# Altium schematic sheet SCH-HC15C_REV1_PG3.SchDoc: MODEL: HC 15C
size 863 x 558 mm; DocumentNumber: SCH-HC15C; SheetNumber: 3; SheetTotal: 3; Title2: HAB'S 1ST GEN CALCULATOR
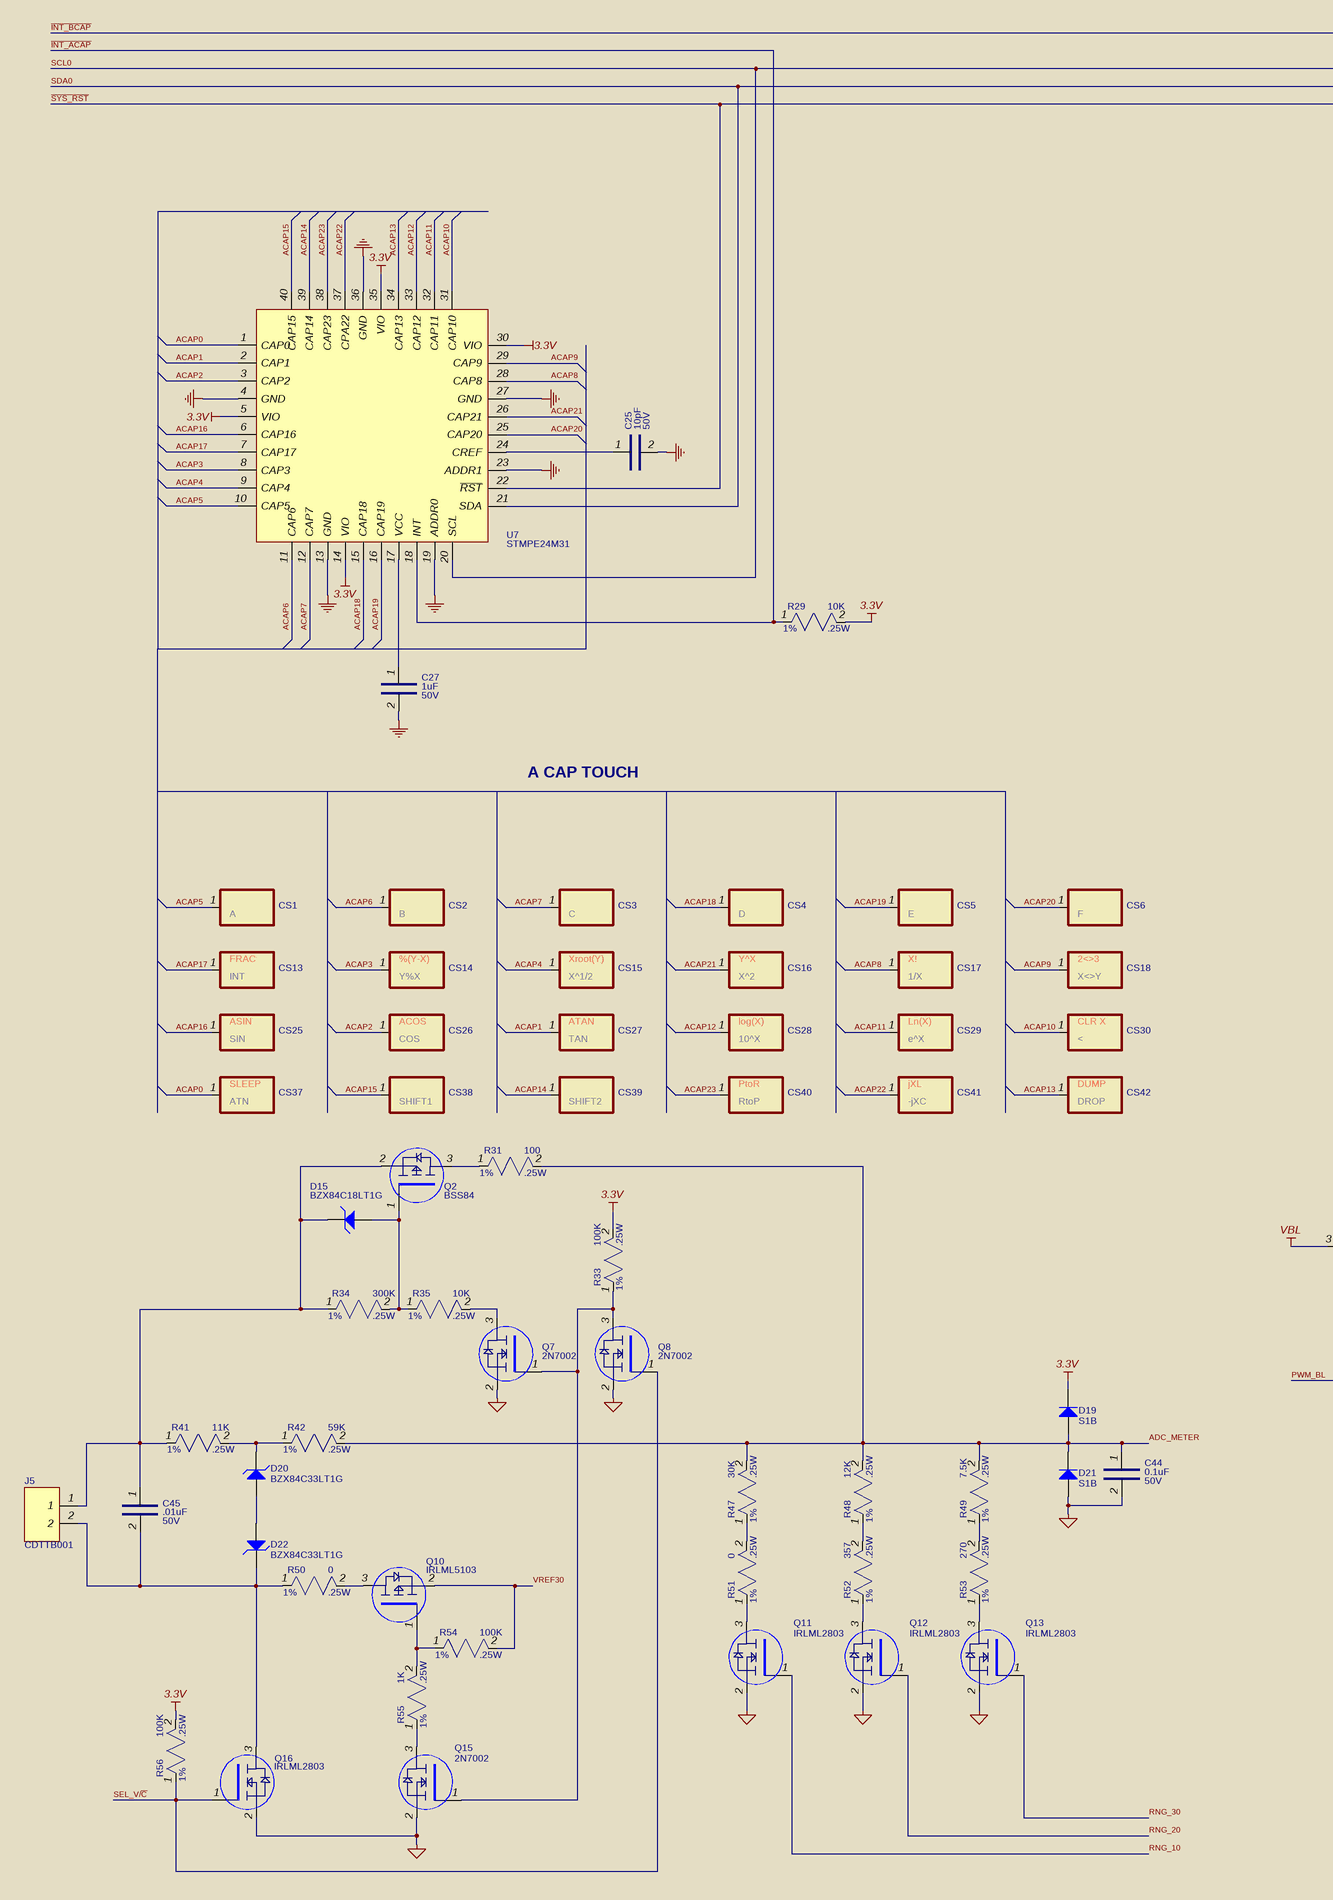
[diagram p0: SCH-HC15C_REV1_PG3.SchDoc, left]
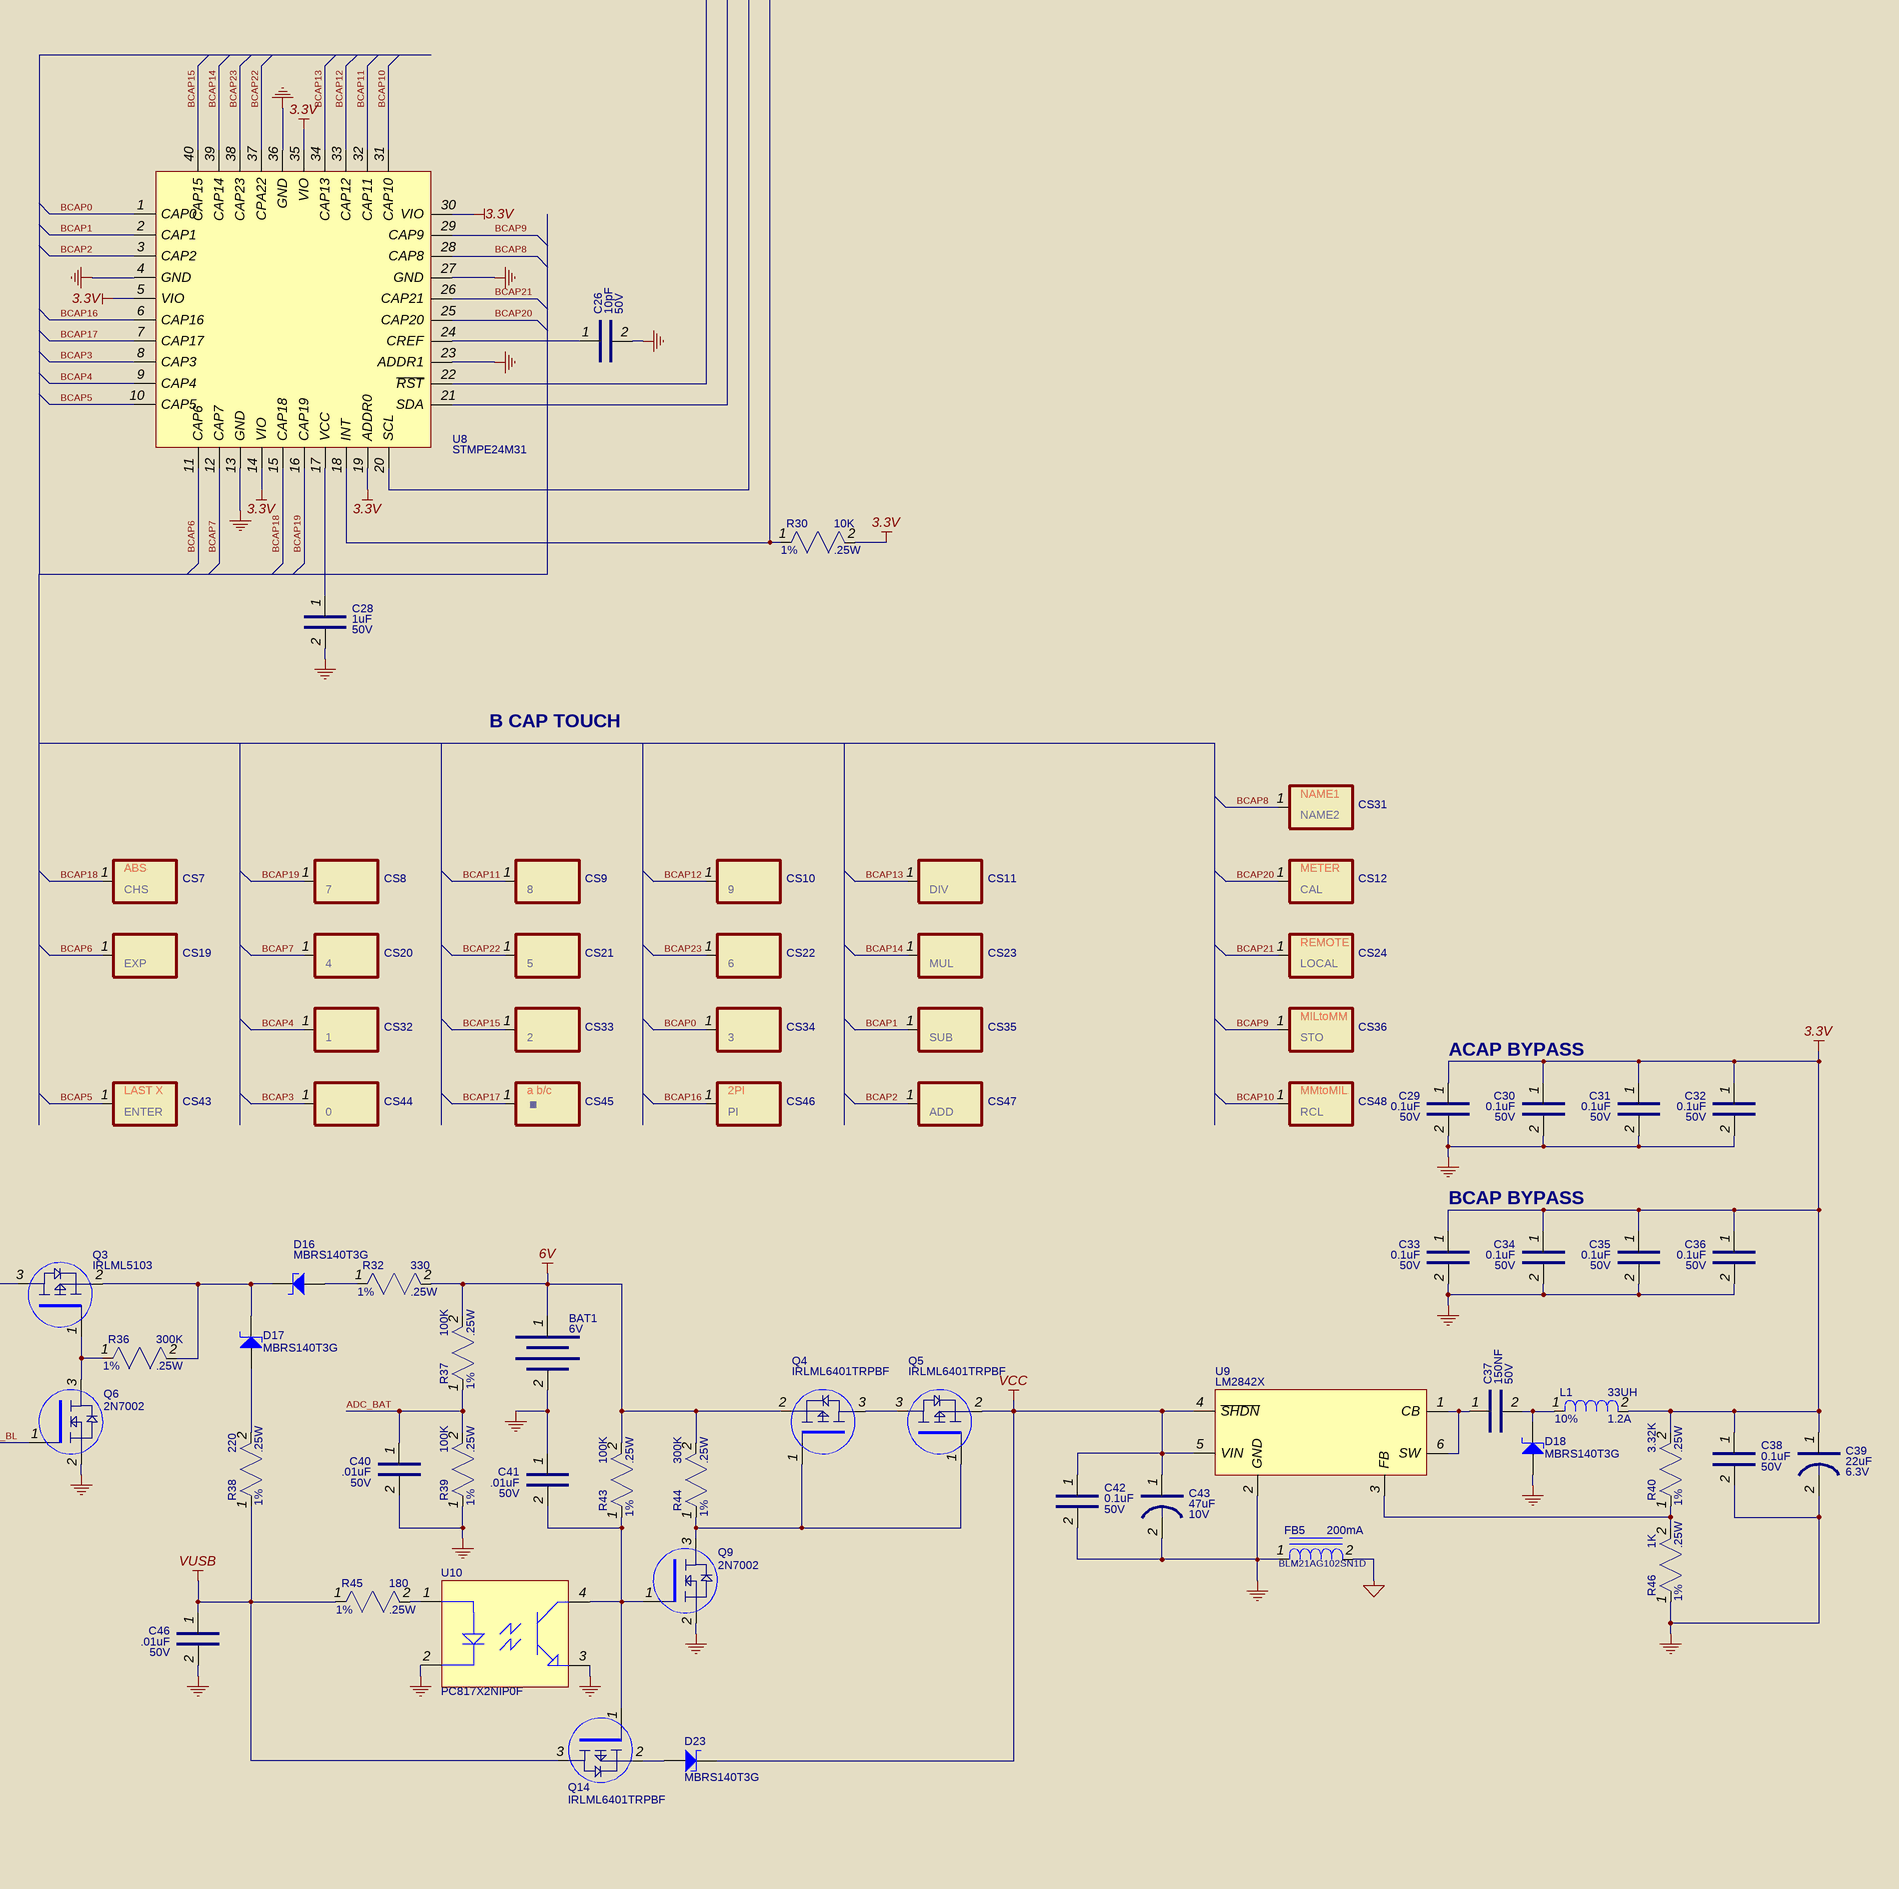
[diagram p1: SCH-HC15C_REV1_PG3.SchDoc, right]

## Parts
BAT1  VOLTAGE: 6V  [KEYSTONE_1062]  (hidden comment: CDEVA00082_1)
C25  value 10pF  VOLTAGE: 50V  [3216[1206] - TAN COLOR]  (hidden comment: CDECA00143)
C26  value 10pF  VOLTAGE: 50V  [3216[1206] - TAN COLOR]  (hidden comment: CDECA00143)
C27  value 1uF  VOLTAGE: 50V  [3225[1210]]  (hidden comment: CDECA00122)
C28  value 1uF  VOLTAGE: 50V  [3225[1210]]  (hidden comment: CDECA00122)
C29  value 0.1uF  VOLTAGE: 50V  [3216[1206] - TAN COLOR]  (hidden comment: CDECA00070)
C30  value 0.1uF  VOLTAGE: 50V  [3216[1206] - TAN COLOR]  (hidden comment: CDECA00070)
C31  value 0.1uF  VOLTAGE: 50V  [3216[1206] - TAN COLOR]  (hidden comment: CDECA00070)
C32  value 0.1uF  VOLTAGE: 50V  [3216[1206] - TAN COLOR]  (hidden comment: CDECA00070)
C33  value 0.1uF  VOLTAGE: 50V  [3216[1206] - TAN COLOR]  (hidden comment: CDECA00070)
C34  value 0.1uF  VOLTAGE: 50V  [3216[1206] - TAN COLOR]  (hidden comment: CDECA00070)
C35  value 0.1uF  VOLTAGE: 50V  [3216[1206] - TAN COLOR]  (hidden comment: CDECA00070)
C36  value 0.1uF  VOLTAGE: 50V  [3216[1206] - TAN COLOR]  (hidden comment: CDECA00070)
C37  value 150NF  VOLTAGE: 50V  [3216[1206] - TAN COLOR]  (hidden comment: CDECA00143_1)
C38  value 0.1uF  VOLTAGE: 50V  [3216[1206] - TAN COLOR]  (hidden comment: CDECA00070)
C39  value 22uF  VOLTAGE: 6.3V  [3216[1206] - TANTALUM]  (hidden comment: CDECA00139_1)
C40  value .01uF  VOLTAGE: 50V  [3216[1206] - TAN COLOR]  (hidden comment: CDECA00085)
C41  value .01uF  VOLTAGE: 50V  [3216[1206] - TAN COLOR]  (hidden comment: CDECA00085)
C42  value 0.1uF  VOLTAGE: 50V  [3216[1206] - TAN COLOR]  (hidden comment: CDECA00070)
C43  value 47uF  VOLTAGE: 10V  [CAP_TANT_3528]  (hidden comment: CDECA00110_1)
C44  value 0.1uF  VOLTAGE: 50V  [3216[1206] - TAN COLOR]  (hidden comment: CDECA00070)
C45  value .01uF  VOLTAGE: 50V  [3216[1206] - TAN COLOR]  (hidden comment: CDECA00085)
C46  value .01uF  VOLTAGE: 50V  [3216[1206] - TAN COLOR]  (hidden comment: CDECA00085)
CS1  VALUE2: A  [CAPTOUCH1_10X10]  (hidden comment: CAP_SENSOR)
CS2  VALUE2: B  [CAPTOUCH1_10X10]  (hidden comment: CAP_SENSOR)
CS3  VALUE2: C  [CAPTOUCH1_10X10]  (hidden comment: CAP_SENSOR)
CS4  VALUE2: D  [CAPTOUCH1_10X10]  (hidden comment: CAP_SENSOR)
CS5  VALUE2: E  [CAPTOUCH1_10X10]  (hidden comment: CAP_SENSOR)
CS6  VALUE2: F  [CAPTOUCH1_10X10]  (hidden comment: CAP_SENSOR)
CS7  value ABS  VALUE2: CHS  [CAPTOUCH1_10X10]  (hidden comment: CAP_SENSOR)
CS8  VALUE2: 7  [CAPTOUCH1_10X10]  (hidden comment: CAP_SENSOR)
CS9  VALUE2: 8  [CAPTOUCH1_10X10]  (hidden comment: CAP_SENSOR)
CS10  VALUE2: 9  [CAPTOUCH1_10X10]  (hidden comment: CAP_SENSOR)
CS11  VALUE2: DIV  [CAPTOUCH1_10X10]  (hidden comment: CAP_SENSOR)
CS12  value METER  VALUE2: CAL  [CAPTOUCH1_10X10]  (hidden comment: CAP_SENSOR)
CS13  value FRAC  VALUE2: INT  [CAPTOUCH1_10X10]  (hidden comment: CAP_SENSOR)
CS14  value %(Y-X)  VALUE2: Y%X  [CAPTOUCH1_10X10]  (hidden comment: CAP_SENSOR)
CS15  value Xroot(Y)  VALUE2: X^1/2  [CAPTOUCH1_10X10]  (hidden comment: CAP_SENSOR)
CS16  value Y^X  VALUE2: X^2  [CAPTOUCH1_10X10]  (hidden comment: CAP_SENSOR)
CS17  value X!  VALUE2: 1/X  [CAPTOUCH1_10X10]  (hidden comment: CAP_SENSOR)
CS18  value 2<>3  VALUE2: X<>Y  [CAPTOUCH1_10X10]  (hidden comment: CAP_SENSOR)
CS19  VALUE2: EXP  [CAPTOUCH1_10X10]  (hidden comment: CAP_SENSOR)
CS20  VALUE2: 4  [CAPTOUCH1_10X10]  (hidden comment: CAP_SENSOR)
CS21  VALUE2: 5  [CAPTOUCH1_10X10]  (hidden comment: CAP_SENSOR)
CS22  VALUE2: 6  [CAPTOUCH1_10X10]  (hidden comment: CAP_SENSOR)
CS23  VALUE2: MUL  [CAPTOUCH1_10X10]  (hidden comment: CAP_SENSOR)
CS24  value REMOTE  VALUE2: LOCAL  [CAPTOUCH1_10X10]  (hidden comment: CAP_SENSOR)
CS25  value ASIN  VALUE2: SIN  [CAPTOUCH1_10X10]  (hidden comment: CAP_SENSOR)
CS26  value ACOS  VALUE2: COS  [CAPTOUCH1_10X10]  (hidden comment: CAP_SENSOR)
CS27  value ATAN  VALUE2: TAN  [CAPTOUCH1_10X10]  (hidden comment: CAP_SENSOR)
CS28  value log(X)  VALUE2: 10^X  [CAPTOUCH1_10X10]  (hidden comment: CAP_SENSOR)
CS29  value Ln(X)  VALUE2: e^X  [CAPTOUCH1_10X10]  (hidden comment: CAP_SENSOR)
CS30  value CLR X  VALUE2: <  [CAPTOUCH1_10X10]  (hidden comment: CAP_SENSOR)
CS31  value NAME1  VALUE2: NAME2  [CAPTOUCH1_10X10]  (hidden comment: CAP_SENSOR)
CS32  VALUE2: 1  [CAPTOUCH1_10X10]  (hidden comment: CAP_SENSOR)
CS33  VALUE2: 2  [CAPTOUCH1_10X10]  (hidden comment: CAP_SENSOR)
CS34  VALUE2: 3  [CAPTOUCH1_10X10]  (hidden comment: CAP_SENSOR)
CS35  VALUE2: SUB  [CAPTOUCH1_10X10]  (hidden comment: CAP_SENSOR)
CS36  value MILtoMM  VALUE2: STO  [CAPTOUCH1_10X10]  (hidden comment: CAP_SENSOR)
CS37  value SLEEP  VALUE2: ATN  [CAPTOUCH1_10X10]  (hidden comment: CAP_SENSOR)
CS38  VALUE2: SHIFT1  [CAPTOUCH1_10X10]  (hidden comment: CAP_SENSOR)
CS39  VALUE2: SHIFT2  [CAPTOUCH1_10X10]  (hidden comment: CAP_SENSOR)
CS40  value PtoR  VALUE2: RtoP  [CAPTOUCH1_10X10]  (hidden comment: CAP_SENSOR)
CS41  value jXL  VALUE2: -jXC  [CAPTOUCH1_10X10]  (hidden comment: CAP_SENSOR)
CS42  value DUMP  VALUE2: DROP  [CAPTOUCH1_10X10]  (hidden comment: CAP_SENSOR)
CS43  value LAST X  VALUE2: ENTER  [CAPTOUCH1_10X23]  (hidden comment: CAP_SENSOR_ENT)
CS44  VALUE2: 0  [CAPTOUCH1_10X10]  (hidden comment: CAP_SENSOR)
CS45  value a b/c  VALUE2: .  [CAPTOUCH1_10X10]  (hidden comment: CAP_SENSOR)
CS46  value 2PI  VALUE2: PI  [CAPTOUCH1_10X10]  (hidden comment: CAP_SENSOR)
CS47  VALUE2: ADD  [CAPTOUCH1_10X10]  (hidden comment: CAP_SENSOR)
CS48  value MMtoMIL  VALUE2: RCL  [CAPTOUCH1_10X10]  (hidden comment: CAP_SENSOR)
D15  value BZX84C18LT1G  [SOT23 - TRANSISTOR]  (hidden comment: CDEDA00055_1)
D16  value MBRS140T3G  [DIODE_SMB]  (hidden comment: CDEDA00019)
D17  value MBRS140T3G  [DIODE_SMB]  (hidden comment: CDEDA00019)
D18  value MBRS140T3G  [DIODE_SMB]  (hidden comment: CDEDA00019)
D19  value S1B  [DIODE SMA]  (hidden comment: CDEDA00055_3)
D20  value BZX84C33LT1G  [SOT23 - TRANSISTOR]  (hidden comment: CDEDA00055_2)
D21  value S1B  [DIODE SMA]  (hidden comment: CDEDA00055_3)
D22  value BZX84C33LT1G  [SOT23 - TRANSISTOR]  (hidden comment: CDEDA00055_2)
D23  value MBRS140T3G  [DIODE_SMB]  (hidden comment: CDEDA00019)
FB5  MFG_PN: BLM21AG102SN1D  POWER: 200mA  [2012[0805]]  (hidden comment: CDEVA00115)
J5  CDTTB001  [PHOENIX_CONTACT_1933189]
L1  value 33UH  TOLERANCE: 10%  POWER: 1.2A  [BOURNS_SDR0805-XXXX]  (hidden comment: CDEHA00005_1)
Q2  value BSS84  [SOT23 - TRANSISTOR]  (hidden comment: CDENA00031_1)
Q3  value IRLML5103  [SOT23 - TRANSISTOR]  (hidden comment: CDENA00031)
Q4  value IRLML6401TRPBF  [SOT23 - TRANSISTOR]  (hidden comment: CDENA00031_3)
Q5  value IRLML6401TRPBF  [SOT23 - TRANSISTOR]  (hidden comment: CDENA00031_3)
Q6  value 2N7002  [SOT23 - TRANSISTOR]  (hidden comment: CDENA00030)
Q7  value 2N7002  [SOT23 - TRANSISTOR]  (hidden comment: CDENA00030)
Q8  value 2N7002  [SOT23 - TRANSISTOR]  (hidden comment: CDENA00030)
Q9  value 2N7002  [SOT23 - TRANSISTOR]  (hidden comment: CDENA00030)
Q10  value IRLML5103  [SOT23 - TRANSISTOR]  (hidden comment: CDENA00031)
Q11  value IRLML2803  [SOT23 - TRANSISTOR]  (hidden comment: CDENA00031_2)
Q12  value IRLML2803  [SOT23 - TRANSISTOR]  (hidden comment: CDENA00031_2)
Q13  value IRLML2803  [SOT23 - TRANSISTOR]  (hidden comment: CDENA00031_2)
Q14  value IRLML6401TRPBF  [SOT23 - TRANSISTOR]  (hidden comment: CDENA00031_3)
Q15  value 2N7002  [SOT23 - TRANSISTOR]  (hidden comment: CDENA00030)
Q16  value IRLML2803  [SOT23 - TRANSISTOR]  (hidden comment: CDENA00031_2)
R29  value 10K  TOLERANCE: 1%  POWER: .25W  [3216[1206]]  (hidden comment: CDERA00170)
R30  value 10K  TOLERANCE: 1%  POWER: .25W  [3216[1206]]  (hidden comment: CDERA00170)
R31  value 100  TOLERANCE: 1%  POWER: .25W  [3216[1206]]  (hidden comment: CDERA00176)
R32  value 330  TOLERANCE: 1%  POWER: .25W  [3216[1206]]  (hidden comment: CDERA00154)
R33  value 100K  TOLERANCE: 1%  POWER: .25W  [3216[1206]]  (hidden comment: CDERA00198)
R34  value 300K  TOLERANCE: 1%  POWER: .25W  [3216[1206]]  (hidden comment: CDERA00275_8)
R35  value 10K  TOLERANCE: 1%  POWER: .25W  [3216[1206]]  (hidden comment: CDERA00170)
R36  value 300K  TOLERANCE: 1%  POWER: .25W  [3216[1206]]  (hidden comment: CDERA00275_8)
R37  value 100K  TOLERANCE: 1%  POWER: .25W  [3216[1206]]  (hidden comment: CDERA00198)
R38  value 220  TOLERANCE: 1%  POWER: .25W  [3216[1206]]  (hidden comment: CDERA00273_2)
R39  value 100K  TOLERANCE: 1%  POWER: .25W  [3216[1206]]  (hidden comment: CDERA00198)
R40  value 3.32K  TOLERANCE: 1%  POWER: .25W  [3216[1206]]  (hidden comment: CDERA00273_1)
R41  value 11K  TOLERANCE: 1%  POWER: .25W  [3216[1206]]  (hidden comment: CDERA00275_2)
R42  value 59K  TOLERANCE: 1%  POWER: .25W  [3216[1206]]  (hidden comment: CDERA00275_7)
R43  value 100K  TOLERANCE: 1%  POWER: .25W  [3216[1206]]  (hidden comment: CDERA00198)
R44  value 300K  TOLERANCE: 1%  POWER: .25W  [3216[1206]]  (hidden comment: CDERA00275_8)
R45  value 180  TOLERANCE: 1%  POWER: .25W  [3216[1206]]  (hidden comment: CDERA00192)
R46  value 1K  TOLERANCE: 1%  POWER: .25W  [3216[1206]]  (hidden comment: CDERA00195)
R47  value 30K  TOLERANCE: 1%  POWER: .25W  [3216[1206]]  (hidden comment: CDERA00275_4)
R48  value 12K  TOLERANCE: 1%  POWER: .25W  [3216[1206]]  (hidden comment: CDERA00275_5)
R49  value 7.5K  TOLERANCE: 1%  POWER: .25W  [3216[1206]]  (hidden comment: CDERA00275_3)
R50  value 0  TOLERANCE: 1%  POWER: .25W  [3216[1206]]  (hidden comment: CDERA00181)
R51  value 0  TOLERANCE: 1%  POWER: .25W  [3216[1206]]  (hidden comment: CDERA00181)
R52  value 357  TOLERANCE: 1%  POWER: .25W  [3216[1206]]  (hidden comment: CDERA00275_6)
R53  value 270  TOLERANCE: 1%  POWER: .25W  [3216[1206]]  (hidden comment: CDERA00209)
R54  value 100K  TOLERANCE: 1%  POWER: .25W  [3216[1206]]  (hidden comment: CDERA00198)
R55  value 1K  TOLERANCE: 1%  POWER: .25W  [3216[1206]]  (hidden comment: CDERA00195)
R56  value 100K  TOLERANCE: 1%  POWER: .25W  [3216[1206]]  (hidden comment: CDERA00198)
U7  value STMPE24M31  [QFN40P500X500X80-41V_MODIFIED]  (hidden comment: CDEUA00052_1)
U8  value STMPE24M31  [QFN40P500X500X80-41V_MODIFIED]  (hidden comment: CDEUA00052_1)
U9  value LM2842X  [TSOT6]  (hidden comment: CDEUA00014_1)
U10  value PC817X2NIP0F  [SHARP_PC817]  (hidden comment: CDEUA00013_1)

## Nets
3.3V: C29.1 C30.1 C31.1 C32.1 C33.1 C34.1 C35.1 C36.1 C38.1 C39.1 D19.2(K) L1.2 R29.2 R30.2 R33.2 R40.2 R56.2 U7.5(VIO) U7.14(VIO) U7.30(VIO) U7.35(VIO) U8.5(VIO) U8.14(VIO) U8.19(ADDR0) U8.30(VIO) U8.35(VIO)
6V: BAT1.1 Q4.2(E) R32.2 R37.2 R43.2 R44.2
GND: BAT1.2 C25.2 C26.2 C27.2 C28.2 C29.2 C30.2 C31.2 C32.2 C33.2 C34.2 C35.2 C36.2 C38.2 C39.2 C40.2 C41.1 C42.2 C43.2 C46.2 D18.1(A) FB5.1 Q6.2(E) Q9.2(E) R39.1 R46.1 U7.4(GND) U7.13(GND) U7.19(ADDR0) U7.23(ADDR1) U7.27(GND) U7.36(GND) U8.4(GND) U8.13(GND) U8.23(ADDR1) U8.27(GND) U8.36(GND) U9.2(GND) U10.2 U10.3
GNDA: C44.2 D21.1(A) FB5.2 Q7.2(E) Q8.2(E) Q11.2(E) Q12.2(E) Q13.2(E) Q15.2(E) Q16.2(E)
VBL: Q3.3(C)
VCC: C42.1 C43.1 D23.2(K) Q5.2(E) U9.4(~{SHDN}) U9.5(VIN)
VUSB: C46.1 Q14.3(C) R38.1 R45.1
~{INT_ACAP}: R29.1 U7.18(INT)
~{INT_BCAP}: R30.1 U8.18(INT)
~{SYS_RST}: U7.22(~{RST}) U8.22(~{RST})
ACAP0: CS37.1 U7.1(CAP0)
ACAP1: CS27.1 U7.2(CAP1)
ACAP2: CS26.1 U7.3(CAP2)
ACAP3: CS14.1 U7.8(CAP3)
ACAP4: CS15.1 U7.9(CAP4)
ACAP5: CS1.1 U7.10(CAP5)
ACAP6: CS2.1 U7.11(CAP6)
ACAP7: CS3.1 U7.12(CAP7)
ACAP8: CS17.1 U7.28(CAP8)
ACAP9: CS18.1 U7.29(CAP9)
ACAP10: CS30.1 U7.31(CAP10)
ACAP11: CS29.1 U7.32(CAP11)
ACAP12: CS28.1 U7.33(CAP12)
ACAP13: CS42.1 U7.34(CAP13)
ACAP14: CS39.1 U7.39(CAP14)
ACAP15: CS38.1 U7.40(CAP15)
ACAP16: CS25.1 U7.6(CAP16)
ACAP17: CS13.1 U7.7(CAP17)
ACAP18: CS4.1 U7.15(CAP18)
ACAP19: CS5.1 U7.16(CAP19)
ACAP20: CS6.1 U7.25(CAP20)
ACAP21: CS16.1 U7.26(CAP21)
ACAP22: CS41.1 U7.37(CPA22)
ACAP23: CS40.1 U7.38(CAP23)
ADC_BAT: C40.1 R37.1 R39.2
ADC_METER: C44.1 D19.1(A) D21.2(K) R31.2 R42.2 R47.2 R48.2 R49.2
BCAP0: CS34.1 U8.1(CAP0)
BCAP1: CS35.1 U8.2(CAP1)
BCAP2: CS47.1 U8.3(CAP2)
BCAP3: CS44.1 U8.8(CAP3)
BCAP4: CS32.1 U8.9(CAP4)
BCAP5: CS43.1 U8.10(CAP5)
BCAP6: CS19.1 U8.11(CAP6)
BCAP7: CS20.1 U8.12(CAP7)
BCAP8: CS31.1 U8.28(CAP8)
BCAP9: CS36.1 U8.29(CAP9)
BCAP10: CS48.1 U8.31(CAP10)
BCAP11: CS9.1 U8.32(CAP11)
BCAP12: CS10.1 U8.33(CAP12)
BCAP13: CS11.1 U8.34(CAP13)
BCAP14: CS23.1 U8.39(CAP14)
BCAP15: CS33.1 U8.40(CAP15)
BCAP16: CS46.1 U8.6(CAP16)
BCAP17: CS45.1 U8.7(CAP17)
BCAP18: CS7.1 U8.15(CAP18)
BCAP19: CS8.1 U8.16(CAP19)
BCAP20: CS12.1 U8.25(CAP20)
BCAP21: CS24.1 U8.26(CAP21)
BCAP22: CS21.1 U8.37(CPA22)
BCAP23: CS22.1 U8.38(CAP23)
PWM_BL: Q6.1(B)
RNG_10: Q11.1(B)
RNG_20: Q12.1(B)
RNG_30: Q13.1(B)
SCL0: U7.20(SCL) U8.20(SCL)
SDA0: U7.21(SDA) U8.21(SDA)
SEL_V/~{C}: Q8.1(B) Q16.1(B) R56.1
VREF30: Q10.2(E) R54.2
NetC25_1: C25.1 U7.24(CREF)
NetC26_1: C26.1 U8.24(CREF)
NetC27_1: C27.1 U7.17(VCC)
NetC28_1: C28.1 U8.17(VCC)
NetC37_1: C37.1 U9.1(CB) U9.6(SW)
NetC37_2: C37.2 D18.2(K) L1.1
NetC41_2: C41.2 Q9.1(B) Q14.1(B) R43.1 U10.4
NetC45_1: C45.1 D15.3(K) J5.1 Q2.2(E) R34.1 R41.1
NetC45_2: C45.2 D22.3(K) J5.2 Q16.3(C) R50.1
NetD15_1: D15.1(A) Q2.1(B) R34.2 R35.1
NetD16_1: D16.1(A) R32.1
NetD16_2: D16.2(K) D17.2(K) Q3.2(E) R36.2
NetD17_1: D17.1(A) R38.2
NetD20_1: D20.1(A) D22.1(A)
NetD20_3: D20.3(K) R41.2 R42.1
NetD23_1: D23.1(A) Q14.2(E)
NetQ2_3: Q2.3(C) R31.1
NetQ3_1: Q3.1(B) Q6.3(C) R36.1
NetQ4_1: Q4.1(B) Q5.1(B) Q9.3(C) R44.1
NetQ4_3: Q4.3(C) Q5.3(C)
NetQ7_1: Q7.1(B) Q8.3(C) Q15.1(B) R33.1
NetQ7_3: Q7.3(C) R35.2
NetQ10_1: Q10.1(B) R54.1 R55.2
NetQ10_3: Q10.3(C) R50.2
NetQ11_3: Q11.3(C) R51.1
NetQ12_3: Q12.3(C) R52.1
NetQ13_3: Q13.3(C) R53.1
NetQ15_3: Q15.3(C) R55.1
NetR40_1: R40.1 R46.2 U9.3(FB)
NetR45_2: R45.2 U10.1
NetR47_1: R47.1 R51.2
NetR48_1: R48.1 R52.2
NetR49_1: R49.1 R53.2

## Notes on the sheet
- A CAP TOUCH
- B CAP TOUCH
- ACAP BYPASS
- BCAP BYPASS
- TITLE:
- SHEET:
- OF
- SCHEMATIC
- DRAWING #:
- 3621 GIN WAY
- SNELLVILLE, GA 30039
- INFORMATION CONTAINED HEREIN IS THE PROPERTY OF SYNERGY
- LIGHTING CONTROLS AND IS TO BE HELD IN COMPLETE CONFIDENCE.
- PHONE: 678-687-0270
- FILENAME:
- FILETYPE:
- REPRODUCE WITH WRITTEN CONSENT ONLY.
- ALTIUM

## Library data of the parts
BAT1 = CDEVA00082_1: CONN, BAT HOLDER 2-COIN CELL 20MM, SMD, ROHS; MFG: KEYSTONE ELECTRONICS; MFG_PN: 1062; Supplier 1: Digi-Key; Supplier Part Number 1: 1062K-ND
C25 C26 = CDECA00143: CAP, CERAMIC, NPO, 10PF, 50V, 1206, 5%, RoHS; MFG: AVX; MFG_PN: 12065A100DAT2A; TOLERANCE: 10%; Supplier 1: Digi-Key; Supplier Part Number 1: 478-5053-1-ND
C27 C28 = CDECA00122: CAP, CERAMIC CHIP 1UF 10% 50V X7R ROHS; MFG: AVX; MFG_PN: GRM32RR71H105K; TOLERANCE: 10%; Supplier 1: Digi-Key; Supplier Part Number 1: 490-1863-1-ND
C29-C36 C38 C42 C44 = CDECA00070: CAP, CERAMIC CHIP 0.1UF 10% 50V X7R ROHS; MFG: AVX; MFG_PN: 12065C104KAT2A; TOLERANCE: 10%; Supplier 1: Digi-Key; Supplier Part Number 1: 478-1556-1-ND
C37 = CDECA00143_1: CAP, CERAMIC, X7R, 150NF, 50V, 1206, 10%, RoHS; MFG: KEMET; MFG_PN: C0805C154K5RACTU; TOLERANCE: 10%; Supplier 1: Digi-Key; Supplier Part Number 1: 399-3489-1-ND
C39 = CDECA00139_1: CAP, TANT, 22UF, 6.3V, 20%, LOW ESR, 1206ROHS; MFG: AVX; MFG_PN: TAJA226K006RNJ; TOLERANCE: 20%; Supplier 1: Digi-Key; Supplier Part Number 1: 478-3865-1-ND
C40 C41 C45 C46 = CDECA00085: CAP, CERAMIC CHIP 0.01UF 10% 50V X7R ROHS; MFG: PANASONIC; MFG_PN: ECJ-1VB1H103K; TOLERANCE: 10%; Supplier 1: Digi-Key; Supplier Part Number 1: PCC1784CT-ND
C43 = CDECA00110_1: CAP, TANT, 47UF, 25V, 20%, 3528 ROHS; MFG: AVX; MFG_PN: TAJB476M010RNJ; TOLERANCE: 20%; Supplier 1: Digi-Key; Supplier Part Number 1: 478-3891-1-ND
CS1-CS6 CS8 CS9 CS19-CS21 CS32 CS33 CS38 CS39 CS44 = CAP_SENSOR: CAP SENSOR FOR PCB; VALUE: NAME1; Published: 8-Jun-2000; LatestRevisionDate: 04-Mar-2005; LatestRevisionNote: PCB Footprint replaced.; PackageReference: J1-0603; Publisher: Altium Limited
CS7 CS12-CS18 CS24-CS31 CS36 CS37 CS40-CS42 CS45 CS46 CS48 = CAP_SENSOR: CAP SENSOR FOR PCB; Published: 8-Jun-2000; LatestRevisionDate: 04-Mar-2005; LatestRevisionNote: PCB Footprint replaced.; PackageReference: J1-0603; Publisher: Altium Limited
CS10 = CAP_SENSOR: CAP SENSOR FOR PCB; VALUE: 9; Published: 8-Jun-2000; LatestRevisionDate: 04-Mar-2005; LatestRevisionNote: PCB Footprint replaced.; PackageReference: J1-0603; Publisher: Altium Limited
CS11 = CAP_SENSOR: CAP SENSOR FOR PCB; VALUE: DIV; Published: 8-Jun-2000; LatestRevisionDate: 04-Mar-2005; LatestRevisionNote: PCB Footprint replaced.; PackageReference: J1-0603; Publisher: Altium Limited
CS22 = CAP_SENSOR: CAP SENSOR FOR PCB; VALUE: 6; Published: 8-Jun-2000; LatestRevisionDate: 04-Mar-2005; LatestRevisionNote: PCB Footprint replaced.; PackageReference: J1-0603; Publisher: Altium Limited
CS23 = CAP_SENSOR: CAP SENSOR FOR PCB; VALUE: MUL; Published: 8-Jun-2000; LatestRevisionDate: 04-Mar-2005; LatestRevisionNote: PCB Footprint replaced.; PackageReference: J1-0603; Publisher: Altium Limited
CS34 = CAP_SENSOR: CAP SENSOR FOR PCB; VALUE: 5; Published: 8-Jun-2000; LatestRevisionDate: 04-Mar-2005; LatestRevisionNote: PCB Footprint replaced.; PackageReference: J1-0603; Publisher: Altium Limited
CS35 = CAP_SENSOR: CAP SENSOR FOR PCB; VALUE: SUB; Published: 8-Jun-2000; LatestRevisionDate: 04-Mar-2005; LatestRevisionNote: PCB Footprint replaced.; PackageReference: J1-0603; Publisher: Altium Limited
CS43 = CAP_SENSOR_ENT: CAP SENSOR FOR PCB; Published: 8-Jun-2000; LatestRevisionDate: 04-Mar-2005; LatestRevisionNote: PCB Footprint replaced.; PackageReference: J1-0603; Publisher: Altium Limited
CS47 = CAP_SENSOR: CAP SENSOR FOR PCB; VALUE: ADD; Published: 8-Jun-2000; LatestRevisionDate: 04-Mar-2005; LatestRevisionNote: PCB Footprint replaced.; PackageReference: J1-0603; Publisher: Altium Limited
D15 = CDEDA00055_1: DIODE, ZENER, 18V, 225MW, SOT-23, ROHS; MFG: ON SEMICONDUCTOR; MFG_PN: BZX84C18LT1G; Supplier 1: Digi-Key; Supplier Part Number 1: BZX84C18LT1GOSCT-ND
D16-D18 D23 = CDEDA00019: Diode, Schottky rectifier, 40V, 1A, SMB package, Pb free; MFG: ON SEMICONDUCTOR; Published: 8-Jun-2000; LatestRevisionDate: 17-Jul-2002; LatestRevisionNote: Re-released for DXP Platform.; DatasheetDocument: 1997; PackageReference: DO-35; Publisher: Altium Limited; Code_JEDEC: DO-204-AH; ComponentLink1Description: Manufacturer Link; ComponentLink1URL: http://www.fairchildsemi.com/; ComponentLink2Description: Datasheet; ComponentLink2URL: http://www.fairchildsemi.com/ds/1N%2F1N4148.pdf; Supplier 1: Digi-Key; Supplier Part Number 1: MBRS140T3GOSCT-ND; MFG_PN: MBRS140T3G
D19 D21 = CDEDA00055_3: DIODE, 1A, 100V, SMA, ROHS; MFG: FAIRCHILD SEMICONDUCTOR; MFG_PN: S1B; Supplier 1: Digi-Key; Supplier Part Number 1: S1BFSCT-ND
D20 D22 = CDEDA00055_2: DIODE, ZENER, 33V, 225MW, SOT-23, ROHS; MFG: ON SEMICONDUCTOR; MFG_PN: BZX84C33LT1G; Supplier 1: Digi-Key; Supplier Part Number 1: BZX84C33LT1GOSCT-ND
FB5 = CDEVA00115: FERRITE, 1KOHM AT 100MHZ, 220MA, .450DCR; MFG: MURATA; VALUE: 1K AT 100MHZ; TOLERANCE: 10%; Published: 8-Jun-2000; LatestRevisionDate: 04-Mar-2005; LatestRevisionNote: PCB Footprint replaced.; PackageReference: J1-0603; Publisher: Altium Limited; Supplier 1: Digi-Key; Supplier Part Number 1: 490-1041-1-ND
J5 = CDTTB001: CONN, HDR, 2PIN, 5MM PHONIX CONTACT, ROHS; MFG_PN: 1933189; MFG: PHOENIX CONTACT; Supplier 1: Digi-Key; Supplier Part Number 1: 277-1645-ND
L1 = CDEHA00005_1: INDUCTOR, 33UH, 10%, SMT, NON-SHIELDED, FERRITE CORE, ROHS; MFG_PN: SDR0805-330KL; MFG: BOURNS; Supplier 1: Digi-Key; Supplier Part Number 1: SDR0805-330KLCT-ND
Q2 = CDENA00031_1: MOSFET P CHN, VDS=50V, RDSON = 10OHM, SOT 23; MFG_PN: BSS84-7-F; MFG: DIODES INC; Published: 8-Jun-2000; LatestRevisionDate: 15-Jan-2003; DatasheetDocument: 1997; PackageDocument: Sep-1998; PackageReference: TO-92A; Publisher: Altium Limited; Code_JEDEC: TO-92A; ComponentLink1Description: Manufacturer Link; ComponentLink1URL: http://www.fairchildsemi.com/; ComponentLink2Description: Datasheet; Supplier 1: Digi-Key; Supplier Part Number 1: P59.0KFCT-ND
Q3 Q10 = CDENA00031: MOSFET P CHN, VDS=30V, RDSON = .6OHM, SOT 23; MFG: INTERNATIONAL RECTIFIER; Published: 8-Jun-2000; LatestRevisionDate: 15-Jan-2003; LatestRevisionNote: PCB Footprint 'BCY-W3/D4.7' replaced; DatasheetDocument: 1997; PackageDocument: Sep-1998; PackageReference: TO-92A; Publisher: Altium Limited; Code_JEDEC: TO-92A; ComponentLink1Description: Manufacturer Link; ComponentLink1URL: http://www.fairchildsemi.com/; ComponentLink2Description: Datasheet; ComponentLink2URL: http://www.fairchildsemi.com/ds/2N%2F2N3904.pdf; Supplier 1: Digi-Key; Supplier 3: Digi-Key; MFG_PN: IRLML5103; Supplier 4: Digi-Key; Supplier Part Number 1: IRLML5103PBFCT-ND
Q4 Q5 Q14 = CDENA00031_3: MOSFET P CHN, VDS=12V, RDSON = .05OHM, SOT 23; MFG_PN: IIRLML6401TRPBF; MFG: INTERNATIONAL RECTIFIER; Published: 8-Jun-2000; LatestRevisionDate: 15-Jan-2003; LatestRevisionNote: PCB Footprint 'BCY-W3/D4.7' replaced; DatasheetDocument: 1997; PackageDocument: Sep-1998; PackageReference: TO-92A; Publisher: Altium Limited; Code_JEDEC: TO-92A; ComponentLink1Description: Manufacturer Link; ComponentLink1URL: http://www.fairchildsemi.com/; ComponentLink2Description: Datasheet; ComponentLink2URL: http://www.fairchildsemi.com/ds/2N%2F2N3904.pdf; Supplier 3: Digi-Key; Supplier 4: Digi-Key; Supplier 1: Digi-Key; Supplier Part Number 1: IRLML6401PBFCT-ND
Q6-Q9 Q15 = CDENA00030: MOSFET N CHN, VDS=60V, 115 mA, SOT 23; MFG_PN: 2N7002-7-F; MFG: DIODES INC; Published: 8-Jun-2000; LatestRevisionDate: 15-Jan-2003; LatestRevisionNote: PCB Footprint 'BCY-W3/D4.7' replaced; DatasheetDocument: 1997; PackageDocument: Sep-1998; PackageReference: TO-92A; Publisher: Altium Limited; Code_JEDEC: TO-92A; ComponentLink1Description: Manufacturer Link; ComponentLink1URL: http://www.fairchildsemi.com/; ComponentLink2Description: Datasheet; ComponentLink2URL: http://www.fairchildsemi.com/ds/2N%2F2N3904.pdf; Supplier 3: Digi-Key; Supplier 4: Digi-Key; Supplier 1: Digi-Key; Supplier Part Number 1: 2N7002-FDICT-ND
Q11-Q13 Q16 = CDENA00031_2: MOSFET N CHN, VDS=60V, 115 mA, SOT 23; MFG_PN: IRLML2803TRPBF; MFG: INTERNATIONAL RECTIFIER; Published: 8-Jun-2000; LatestRevisionDate: 15-Jan-2003; LatestRevisionNote: PCB Footprint 'BCY-W3/D4.7' replaced; PackageDocument: Sep-1998; PackageReference: TO-92A; Publisher: Altium Limited; Code_JEDEC: TO-92A; ComponentLink1Description: Manufacturer Link; ComponentLink2Description: Datasheet; Supplier 1: Digi-Key; Supplier Part Number 1: IRLML2803PBFCT-ND
R29 R30 R35 = CDERA00170: RESISTOR, CHIP 1206 10K OHM 1% 1/4W THICK FILM ROHS; MFG: PANASONIC; MFG_PN: ERJ-8GEYJ103V; Published: 8-Jun-2000; LatestRevisionDate: 04-Mar-2005; LatestRevisionNote: PCB Footprint replaced.; PackageReference: J1-0603; Publisher: Altium Limited; Supplier 1: Digi-Key; Supplier 2: Digi-Key; Supplier Part Number 1: P10KECT-ND; Supplier Part Number 2: 311-10KERCT-ND
R31 = CDERA00176: RESISTOR, CHIP 1206 100 OHM 1% 1/4W THICK FILM ROHS; MFG: PANASONIC; MFG_PN: ERJ-8GEYJ101V; Published: 8-Jun-2000; LatestRevisionDate: 04-Mar-2005; LatestRevisionNote: PCB Footprint replaced.; PackageReference: J1-0603; Publisher: Altium Limited; Supplier 1: Digi-Key; Supplier Part Number 1: P100ECT-ND
R32 = CDERA00154: RESISTOR, CHIP 1206 330 OHM 1% 1/4W THICK FILM ROHS; MFG: PANASONIC; MFG_PN: ERJ-8ENF3300V; Published: 8-Jun-2000; LatestRevisionDate: 04-Mar-2005; LatestRevisionNote: PCB Footprint replaced.; PackageReference: J1-0603; Publisher: Altium Limited; Supplier 1: Digi-Key; Supplier Part Number 1: P330FTR-ND
R33 R37 R39 R43 R54 R56 = CDERA00198: RESISTOR, CHIP 1206 100K OHM 1% 1/4W THICK FILM ROHS; MFG: PANASONIC; MFG_PN: ERJ-8ENF1003V; Published: 8-Jun-2000; LatestRevisionDate: 04-Mar-2005; LatestRevisionNote: PCB Footprint replaced.; PackageReference: J1-0603; Publisher: Altium Limited; Supplier 1: Digi-Key; Supplier Part Number 1: P100KFCT-ND
R34 R36 R44 = CDERA00275_8: RESISTOR, CHIP 1206 300K OHM 1% 1/4W THICK FILM ROHS; MFG: PANASONIC; MFG_PN: ERJ-8ENF3003V; Published: 8-Jun-2000; LatestRevisionDate: 04-Mar-2005; LatestRevisionNote: PCB Footprint replaced.; PackageReference: J1-0603; Publisher: Altium Limited; Supplier 1: Digi-Key; Supplier Part Number 1: P300KFCT-ND
R38 = CDERA00273_2: RESISTOR, CHIP 1206 220 OHM 1% 1/4W THICK FILM ROHS; MFG: PANASONIC; MFG_PN: ERJ-8ENF2200V; Published: 8-Jun-2000; LatestRevisionDate: 04-Mar-2005; LatestRevisionNote: PCB Footprint replaced.; PackageReference: J1-0603; Publisher: Altium Limited; Supplier 1: Digi-Key; Supplier Part Number 1: P220FCT-ND
R40 = CDERA00273_1: RESISTOR, CHIP 1206 3.32K OHM 1% 1/4W THICK FILM ROHS; MFG: PANASONIC; MFG_PN: ERJ-8ENF3321V; Published: 8-Jun-2000; LatestRevisionDate: 04-Mar-2005; LatestRevisionNote: PCB Footprint replaced.; PackageReference: J1-0603; Publisher: Altium Limited; Supplier 1: Digi-Key; Supplier Part Number 1: P3.32KFCT-ND
R41 = CDERA00275_2: RESISTOR, CHIP 1206 11K OHM 1% 1/4W THICK FILM ROHS; MFG: PANASONIC; MFG_PN: ERJ-8ENF1102V; Published: 8-Jun-2000; LatestRevisionDate: 04-Mar-2005; LatestRevisionNote: PCB Footprint replaced.; PackageReference: J1-0603; Publisher: Altium Limited; Supplier 1: Digi-Key; Supplier Part Number 1: P11.0KFCT-ND
R42 = CDERA00275_7: RESISTOR, CHIP 1206 59K OHM 1% 1/4W THICK FILM ROHS; MFG: PANASONIC; MFG_PN: ERJ-8ENF5902V; Published: 8-Jun-2000; LatestRevisionDate: 04-Mar-2005; LatestRevisionNote: PCB Footprint replaced.; PackageReference: J1-0603; Publisher: Altium Limited; Supplier 1: Digi-Key; Supplier Part Number 1: P59.0KFCT-ND
R45 = CDERA00192: RESISTOR, CHIP 1206 180 OHM 1% 1/4W THICK FILM ROHS; MFG: PANASONIC; MFG_PN: ERJ-8ENF1800V; Published: 8-Jun-2000; LatestRevisionDate: 04-Mar-2005; LatestRevisionNote: PCB Footprint replaced.; PackageReference: J1-0603; Publisher: Altium Limited; Supplier 1: Digi-Key; Supplier Part Number 1: P180FCT-ND
R46 R55 = CDERA00195: RESISTOR, CHIP 1206 1K OHM 1% 1/4W THICK FILM ROHS; MFG: PANASONIC; MFG_PN: ERJ-8ENF1001V; Published: 8-Jun-2000; LatestRevisionDate: 04-Mar-2005; LatestRevisionNote: PCB Footprint replaced.; PackageReference: J1-0603; Publisher: Altium Limited; Supplier 1: Digi-Key; Supplier Part Number 1: P1.00KFCT-ND
R47 = CDERA00275_4: RESISTOR, CHIP 1206 30K OHM 1% 1/4W THICK FILM ROHS; MFG: PANASONIC; MFG_PN: ERJ-8ENF3002V; Published: 8-Jun-2000; LatestRevisionDate: 04-Mar-2005; LatestRevisionNote: PCB Footprint replaced.; PackageReference: J1-0603; Publisher: Altium Limited; Supplier 1: Digi-Key; Supplier Part Number 1: P30.0KFCT-ND
R48 = CDERA00275_5: RESISTOR, CHIP 1206 12K OHM 1% 1/4W THICK FILM ROHS; MFG: PANASONIC; MFG_PN: ERJ-8ENF1202V; Published: 8-Jun-2000; LatestRevisionDate: 04-Mar-2005; LatestRevisionNote: PCB Footprint replaced.; PackageReference: J1-0603; Publisher: Altium Limited; Supplier 1: Digi-Key; Supplier Part Number 1: P12.0KFCT-ND
R49 = CDERA00275_3: RESISTOR, CHIP 1206 7.5K OHM 1% 1/4W THICK FILM ROHS; MFG: PANASONIC; MFG_PN: ERJ-8ENF7501V; Published: 8-Jun-2000; LatestRevisionDate: 04-Mar-2005; LatestRevisionNote: PCB Footprint replaced.; PackageReference: J1-0603; Publisher: Altium Limited; Supplier 1: Digi-Key; Supplier Part Number 1: P7.50KFCT-ND
R50 R51 = CDERA00181: RESISTOR, CHIP 1206 0.0 OHM 1% 1/4W THICK FILM ROHS; MFG: PANASONIC; MFG_PN: ERJ-8GEYJ122V; Published: 8-Jun-2000; LatestRevisionDate: 04-Mar-2005; LatestRevisionNote: PCB Footprint replaced.; PackageReference: J1-0603; Publisher: Altium Limited; Supplier 1: Digi-Key; Supplier Part Number 1: P0.0ECT-ND
R52 = CDERA00275_6: RESISTOR, CHIP 1206 357 OHM 1% 1/4W THICK FILM ROHS; MFG: PANASONIC; MFG_PN: ERJ-8ENF3570V; Published: 8-Jun-2000; LatestRevisionDate: 04-Mar-2005; LatestRevisionNote: PCB Footprint replaced.; PackageReference: J1-0603; Publisher: Altium Limited; Supplier 1: Digi-Key; Supplier Part Number 1: P357FCT-ND
R53 = CDERA00209: RESISTOR, CHIP 1206 270 OHM 1% 1/4W THICK FILM ROHS; MFG: PANASONIC; MFG_PN: ERJ-8ENF2700V; Published: 8-Jun-2000; LatestRevisionDate: 04-Mar-2005; LatestRevisionNote: PCB Footprint replaced.; PackageReference: J1-0603; Publisher: Altium Limited; Supplier 1: Digi-Key; Supplier Part Number 1: P270FCT-ND
U7 U8 = CDEUA00052_1: IC, TOUCHKEY CONTROLLER, 24CH, I2C, 40QFN; MFG: ST; Published: 8-Jun-2000; LatestRevisionDate: 17-Jul-2002; LatestRevisionNote: Re-released for DXP Platform.; DatasheetDocument: 1997; Publisher: Altium Limited; Code_JEDEC: DO-204-AH; ComponentLink1Description: Manufacturer Link; ComponentLink1URL: http://www.fairchildsemi.com/; ComponentLink2Description: Datasheet; ComponentLink2URL: http://www.fairchildsemi.com/ds/1N%2F1N4148.pdf; MFG_PN: STMPE24M31; Supplier 1: Digi-Key; Supplier Part Number 1: 497-10380-1-ND
U9 = CDEUA00014_1: IC, BUCK REGULATOR, 0.6A, TSOT23-6; MFG: NATIONAL SEMICONDUCTOR; MFG_PN: LM2842XMK-ADJL/NOPB; Supplier 1: Digi-Key; Supplier Part Number 1: LM2842XMK-ADJLCT-ND
U10 = CDEUA00013_1: IC, PHOTOCOUPLER, NPN OUTPUT - NO BASE, SM, ROHS; MFG: SHARP MICROELECTRONICS; MFG_PN: PC817X2NIP0F; Supplier 1: Digi-Key; Supplier Part Number 1: 425-2192-1-ND